# EAGLE schematic first_prototype (EAGLE 7.7.0)
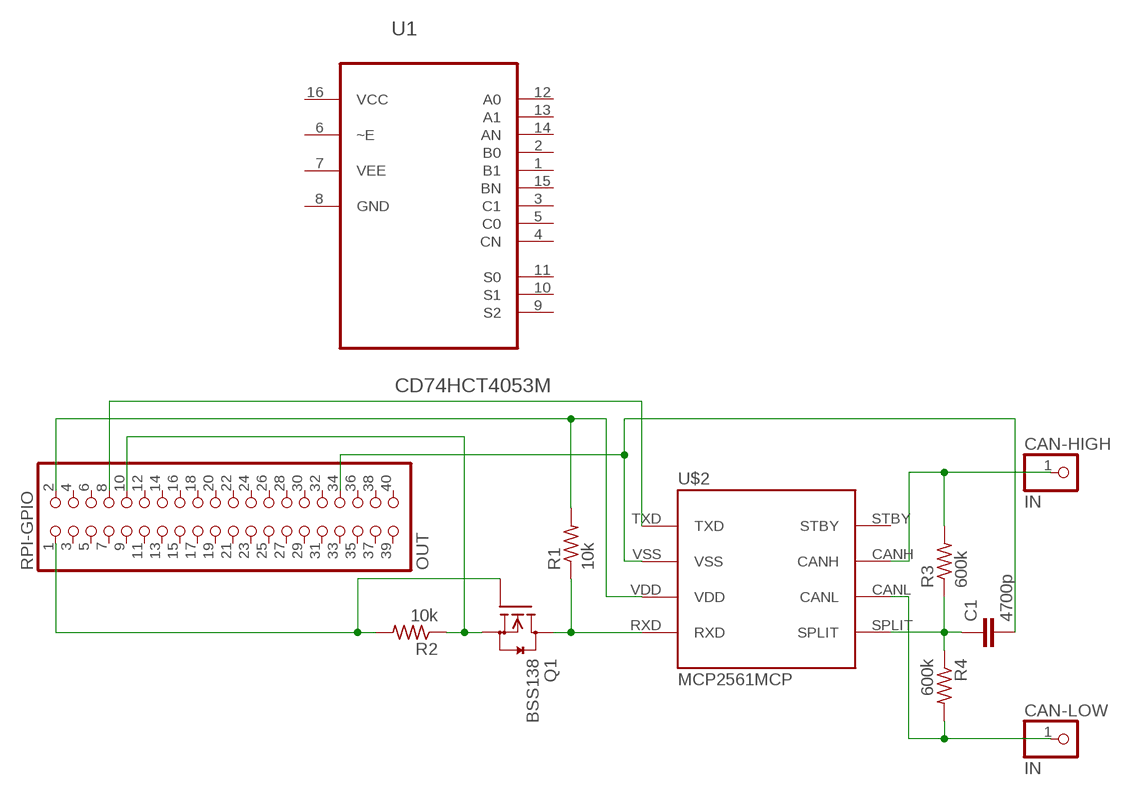
[diagram p0: schematic, sheet 1]

## Parts
C1  4700p  C2.5/2  [C2.5-2]
CAN-HIGH  IN  PINHD-1X1  [1X01]
CAN-LOW  IN  PINHD-1X1  [1X01]
Q1  BSS138  [SOT23]
R1  10k  R-US_M2309  [M2309]
R2  10k  R-US_M2309  [M2309]
R3  600k  R-US_M2309  [M2309]
R4  600k  R-US_M2309  [M2309]
RPI-GPIO  OUT  PINHD-2X20  [2X20]
U1  CD74HCT4053M  [SOIC127P600X175-16N]
U$2  MCP2561MCP  [MCP2561_PDIP]

## Nets
N$1: Q1.2(S) R2.1 RPI-GPIO.10
N$2: Q1.3(D) R1.1 U$2.RXD
N$3: RPI-GPIO.8 U$2.TXD
N$4: R1.2 RPI-GPIO.2 U$2.VDD
N$5: C1.2 RPI-GPIO.34 U$2.VSS
N$6: Q1.1(G) R2.2 RPI-GPIO.1
N$7: C1.1 R3.1 R4.1 U$2.SPLIT
N$8: CAN-HIGH.1 R3.2 U$2.CANH
N$9: CAN-LOW.1 R4.2 U$2.CANL
Unconnected: RPI-GPIO.3 RPI-GPIO.4 RPI-GPIO.5 RPI-GPIO.6 RPI-GPIO.7 RPI-GPIO.9 RPI-GPIO.11 RPI-GPIO.12 RPI-GPIO.13 RPI-GPIO.14 RPI-GPIO.15 RPI-GPIO.16 RPI-GPIO.17 RPI-GPIO.18 RPI-GPIO.19 RPI-GPIO.20 RPI-GPIO.21 RPI-GPIO.22 RPI-GPIO.23 RPI-GPIO.24 RPI-GPIO.25 RPI-GPIO.26 RPI-GPIO.27 RPI-GPIO.28 RPI-GPIO.29 RPI-GPIO.30 RPI-GPIO.31 RPI-GPIO.32 RPI-GPIO.33 RPI-GPIO.35 RPI-GPIO.36 RPI-GPIO.37 RPI-GPIO.38 RPI-GPIO.39 RPI-GPIO.40 U1.1(B1) U1.2(B0) U1.3(C1) U1.4(CN) U1.5(C0) U1.6(~E) U1.7(VEE) U1.8(GND) U1.9(S2) U1.10(S1) U1.11(S0) U1.12(A0) U1.13(A1) U1.14(AN) U1.15(BN) U$2.STBY

## Power pins joined to a net without a drawn wire
VCC: U1.16(VCC)

## Library data of the parts
C1 = capacitor-wima:C: CAPACITOR naming: grid - package width
CAN-HIGH CAN-LOW = pinhead:PINHD-1X1: PIN HEADER
Q1 = m-pad-2.1:BSS138: Fairchild Semiconductors BSS138 N-Channel Logic Level Enhancement Mode Field Effect Transistor General Description: These N-Channel enhancement mode field effect transistors are produced using Fairchild's proprietary, high cell density, DMOS technology. These products have been designed to minimize on-state resistance while provide rugged, reliable, and fast switching performance.These products are particularly suited for low voltage, low current applications such as small servo motor control, power MOSFET gate drivers, and other switching applications. Features: 0.22 A, 50 V. RDS(ON) = 3.5Ohm @ VGS = 10 V RDS(ON) = 6.0Ohm @ VGS = 4.5 V High density cell design for extremely low RDS(ON) Rugged and Reliable Compact industry standard SOT-23 surface mount package Please send any comments to: messi@users.sourceforge.net
R1-R4 = rcl:R-US_: RESISTOR, American symbol
RPI-GPIO = pinhead:PINHD-2X20: PIN HEADER
U1 = Texas Instruments_By_element14_Batch_1:CD74HCT4053M: HIGH-SPEED CMOS LOGIC ANALOG MULTIPLEXERS/DEMULTIPLEXERS; MPN: CD74HCT4053M; OC_FARNELL: 1103149; OC_NEWARK: 25M8610; PACKAGE: SOIC-16; SUPPLIER: TEXAS INSTRUMENTS
U$2 = mcp2561:MCP2561: High-Speed CAN Transceiver See http://ww1.microchip.com/downloads/en/DeviceDoc/25167A.pdf The MCP2561/2 is a Microchip Technology Inc. second generation high-speed CAN transceiver. It serves as an interface between a CAN protocol controller and the physical two-wire CAN bus. The device meets the automotive requirements for high-speed (up to 1 Mb/s), low quiescent current, electromagnetic compatibility (EMC) and electrostatic discharge (ESD).